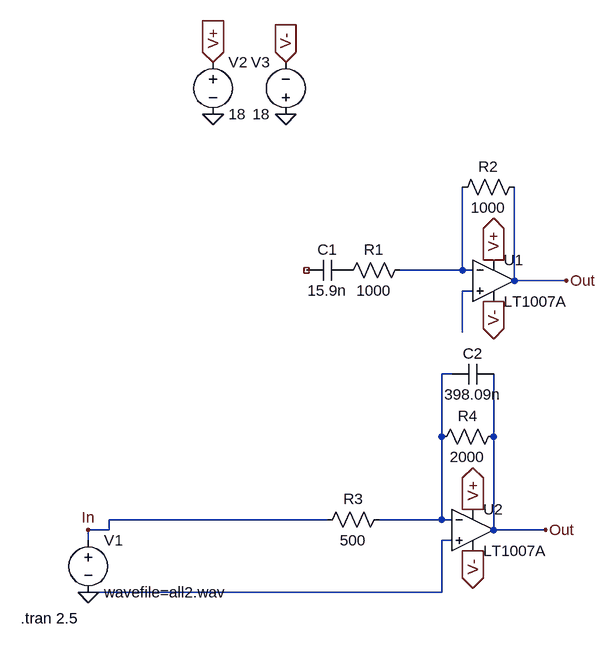
[diagram p0: schematic ampliOp_filter.asc]
ampliOp_filter.asc, the LTspice schematic file:
Version 4
SHEET 1 880 696
WIRE 368 144 368 16
WIRE 368 144 272 144
WIRE 384 144 368 144
WIRE 448 160 448 16
WIRE 528 160 448 160
WIRE 384 176 368 176
WIRE 368 240 368 176
WIRE 352 304 336 304
WIRE 336 400 336 304
WIRE 416 400 416 304
WIRE 160 528 -176 528
WIRE 336 528 336 400
WIRE 336 528 240 528
WIRE 352 528 336 528
WIRE -176 544 -176 528
WIRE -176 544 -208 544
WIRE 416 544 416 400
WIRE 496 544 416 544
WIRE -208 560 -208 544
WIRE 352 560 336 560
WIRE 336 640 336 560
WIRE 336 640 -208 640
FLAG -208 640 0
FLAG 528 160 Out
FLAG -208 544 In
FLAG -16 -96 0
FLAG 96 -96 0
FLAG -16 -176 V+
IOPIN -16 -176 In
FLAG 96 -176 V-
IOPIN 96 -176 In
FLAG 416 128 V+
IOPIN 416 128 Out
FLAG 416 192 V-
IOPIN 416 192 Out
FLAG 496 544 Out
FLAG 384 512 V+
IOPIN 384 512 Out
FLAG 384 576 V-
IOPIN 384 576 Out
SYMBOL voltage -208 544 R0
SYMATTR InstName V1
SYMATTR Value wavefile=all2.wav
SYMBOL OpAmps\\LT1007A 416 96 R0
SYMATTR InstName U1
SYMBOL cap 192 128 R90
WINDOW 0 0 32 VBottom 2
WINDOW 3 32 32 VTop 2
SYMATTR InstName C1
SYMATTR Value 15.9n
SYMBOL res 288 128 R90
WINDOW 0 0 56 VBottom 2
WINDOW 3 32 56 VTop 2
SYMATTR InstName R1
SYMATTR Value 1000
SYMBOL res 464 0 R90
WINDOW 0 0 56 VBottom 2
WINDOW 3 32 56 VTop 2
SYMATTR InstName R2
SYMATTR Value 1000
SYMBOL voltage -16 -192 R0
WINDOW 123 0 0 Left 0
WINDOW 39 0 0 Left 0
SYMATTR InstName V2
SYMATTR Value 18
SYMBOL voltage 96 -80 R180
WINDOW 0 24 96 Left 2
WINDOW 3 24 16 Left 2
WINDOW 123 0 0 Left 0
WINDOW 39 0 0 Left 0
SYMATTR InstName V3
SYMATTR Value 18
SYMBOL OpAmps\\LT1007A 384 480 R0
SYMATTR InstName U2
SYMBOL cap 416 288 R90
WINDOW 0 0 32 VBottom 2
WINDOW 3 32 32 VTop 2
SYMATTR InstName C2
SYMATTR Value 398.09n
SYMBOL res 256 512 R90
WINDOW 0 0 56 VBottom 2
WINDOW 3 32 56 VTop 2
SYMATTR InstName R3
SYMATTR Value 500
SYMBOL res 432 384 R90
WINDOW 0 0 56 VBottom 2
WINDOW 3 32 56 VTop 2
SYMATTR InstName R4
SYMATTR Value 2000
TEXT -312 680 Left 2 !.tran 2.5

The netlist it stands for:
* ampliOp_filter.asc
V1 In 0 wavefile=all2.wav
XU1 N002 N001 V+ V- Out LT1007A  ; pins In+ In- V+ V- OUT
C1 P001 NC_01 15.9n
R1 N001 P001 1000
R2 Out N001 1000
V2 V+ 0 18
V3 0 V- 18
XU2 0 N003 V+ V- Out LT1007A  ; pins In+ In- V+ V- OUT
C2 Out N003 398.09n
R3 N003 In 500
R4 Out N003 2000
.tran 2.5
.backanno
.end